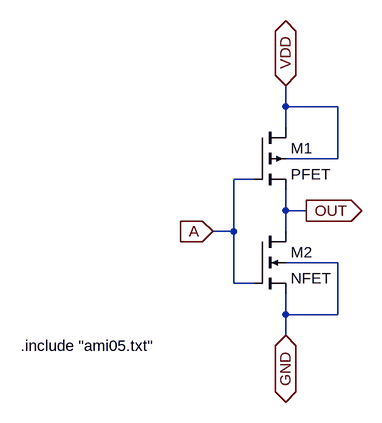
[diagram p0: schematic not.asc]
not.asc, the LTspice schematic file:
Version 4
SHEET 1 880 680
WIRE 160 -48 160 -80
WIRE 240 -48 160 -48
WIRE 160 -16 160 -48
WIRE 240 32 240 -48
WIRE 240 32 160 32
WIRE 112 64 80 64
WIRE 160 112 160 80
WIRE 192 112 160 112
WIRE 80 144 80 64
WIRE 80 144 48 144
WIRE 160 144 160 112
WIRE 240 192 160 192
WIRE 80 224 80 144
WIRE 112 224 80 224
WIRE 160 272 160 240
WIRE 240 272 240 192
WIRE 240 272 160 272
WIRE 160 304 160 272
FLAG 160 -80 VDD
IOPIN 160 -80 BiDir
FLAG 160 304 GND
IOPIN 160 304 BiDir
FLAG 192 112 OUT
IOPIN 192 112 Out
FLAG 48 144 A
IOPIN 48 144 In
SYMBOL pmos4 112 -16 R0
SYMATTR InstName M1
SYMATTR Value PFET
SYMATTR Value2 l=0.6u w=3u
SYMBOL nmos4 112 144 R0
SYMATTR InstName M2
SYMATTR Value NFET
SYMATTR Value2 l=0.6u w=1.5u
TEXT -248 320 Left 2 !.include "ami05.txt"

The netlist it stands for:
* not.asc
M1 VDD A OUT VDD PFET l=0.6u w=3u
M2 OUT A GND GND NFET l=0.6u w=1.5u
.model NMOS NMOS
.model PMOS PMOS
.lib standard.mos
.include "ami05.txt"
.backanno
.end